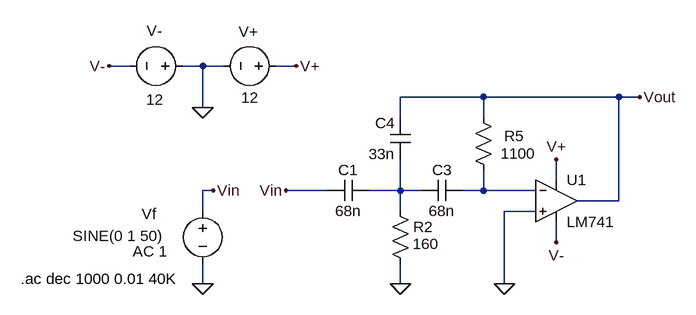
[diagram p0: schematic MFB-HPF.asc]
MFB-HPF.asc, the LTspice schematic file:
Version 4
SHEET 1 880 680
WIRE -464 -16 -496 -16
WIRE -352 -16 -384 -16
WIRE -320 -16 -352 -16
WIRE -208 -16 -240 -16
WIRE 80 32 -48 32
WIRE 288 32 80 32
WIRE 320 32 288 32
WIRE -352 48 -352 -16
WIRE -48 64 -48 32
WIRE 80 64 80 32
WIRE 192 160 192 128
WIRE -336 176 -352 176
WIRE -160 176 -224 176
WIRE -48 176 -48 128
WIRE -48 176 -96 176
WIRE -16 176 -48 176
WIRE 80 176 80 144
WIRE 80 176 48 176
WIRE 160 176 80 176
WIRE 288 192 288 32
WIRE 288 192 224 192
WIRE -352 208 -352 176
WIRE -48 208 -48 176
WIRE 160 208 112 208
WIRE 192 256 192 224
WIRE -352 320 -352 288
WIRE -48 320 -48 288
WIRE 112 320 112 208
FLAG -48 320 0
FLAG -352 320 0
FLAG 112 320 0
FLAG -208 -16 V+
FLAG 192 128 V+
FLAG -496 -16 V-
FLAG 192 256 V-
FLAG 320 32 Vout
FLAG -336 176 Vin
FLAG -224 176 Vin
FLAG -352 48 0
SYMBOL cap 48 160 R90
WINDOW 0 0 32 VBottom 2
WINDOW 3 32 32 VTop 2
SYMATTR InstName C3
SYMATTR Value 68n
SYMBOL cap -96 160 R90
WINDOW 0 0 32 VBottom 2
WINDOW 3 32 32 VTop 2
SYMATTR InstName C1
SYMATTR Value 68n
SYMBOL cap -32 128 R180
WINDOW 0 24 56 Left 2
WINDOW 3 24 8 Left 2
SYMATTR InstName C4
SYMATTR Value 33n
SYMBOL res -64 192 R0
WINDOW 3 35 66 Left 2
SYMATTR Value 160
SYMATTR InstName R2
SYMBOL res 64 48 R0
WINDOW 0 48 44 Left 2
WINDOW 3 42 71 Left 2
SYMATTR InstName R5
SYMATTR Value 1100
SYMBOL voltage -352 192 R0
WINDOW 123 -108 78 Left 2
WINDOW 39 0 0 Left 0
WINDOW 0 -94 20 Left 2
WINDOW 3 -200 54 Left 2
SYMATTR Value2 AC 1
SYMATTR InstName Vf
SYMATTR Value SINE(0 1 50)
SYMBOL voltage -224 -16 R90
WINDOW 123 0 0 Left 0
WINDOW 39 0 0 Left 0
WINDOW 0 -53 43 VRight 2
WINDOW 3 49 42 VRight 2
SYMATTR InstName V+
SYMATTR Value 12
SYMBOL voltage -368 -16 R90
WINDOW 123 0 0 Left 0
WINDOW 39 0 0 Left 0
WINDOW 0 -54 46 VRight 2
WINDOW 3 52 44 VRight 2
SYMATTR InstName V-
SYMATTR Value 12
SYMBOL LM741 192 128 R0
SYMATTR InstName U1
TEXT -632 312 Left 2 !.ac dec 1000 0.01 40K

The netlist it stands for:
* MFB-HPF.asc
C3 N002 N001 68n
C1 N001 Vin 68n
C4 N001 Vout 33n
R2 N001 0 160
R5 Vout N002 1100
Vf Vin 0 SINE(0 1 50) AC 1
V+ V+ 0 12
V- 0 V- 12
XU1 0 N002 V+ V- Vout LM741  ; pins In+ In- V+ V- OUT
.ac dec 1000 0.01 40K
.lib LM741.lib
.backanno
.end

* Results of the author's LTspice run, read from the files saved beside the schematic
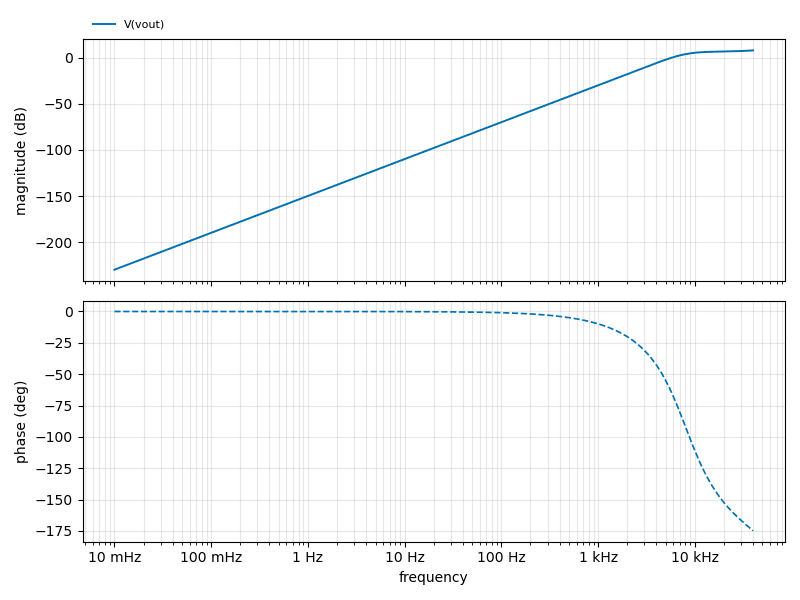
[diagram p1: AC Analysis of MFB-HPF.asc, plotted from the saved traces]
* AC Analysis, 1 run:
*   V(vout): -229.86 dB at 10 mHz, 7.86 dB at 40 kHz, peak 7.86 dB at 40 kHz, 3 dB below the peak at 9.191 kHz